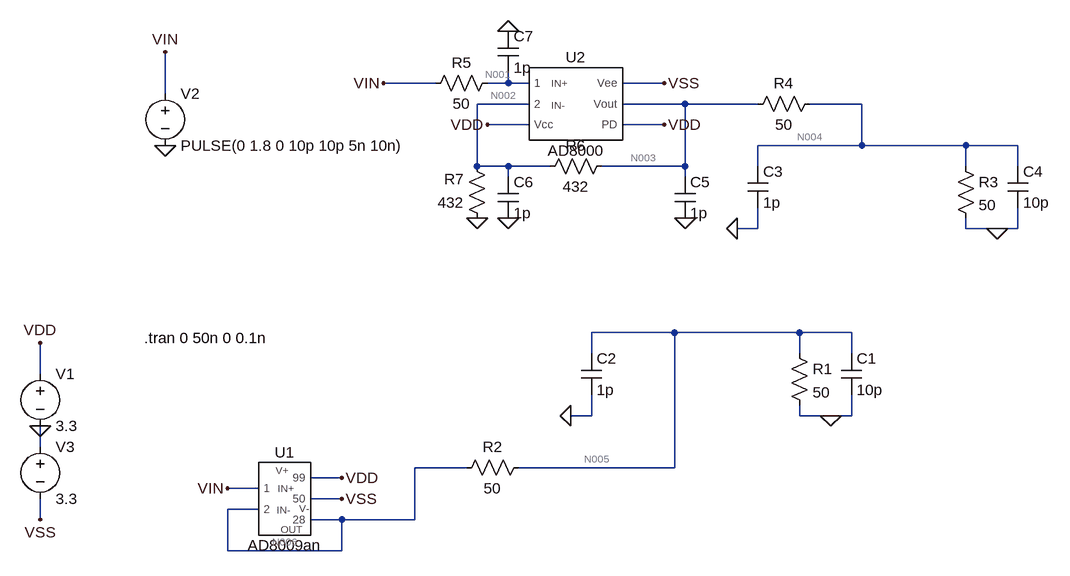
[diagram p0: schematic buffer.asc]
buffer.asc, the LTspice schematic file:
Version 4
SHEET 1 1032 912
WIRE 80 144 0 144
WIRE 192 144 192 128
WIRE 192 144 160 144
WIRE 224 144 192 144
WIRE 432 144 368 144
WIRE -336 160 -336 96
WIRE 224 176 144 176
WIRE 464 176 368 176
WIRE 576 176 464 176
WIRE 736 176 656 176
WIRE 224 208 160 208
WIRE 432 208 368 208
WIRE 736 240 736 176
WIRE 736 240 576 240
WIRE 896 240 736 240
WIRE 976 240 896 240
WIRE 144 272 144 176
WIRE 192 272 144 272
WIRE 256 272 192 272
WIRE 464 272 464 176
WIRE 464 272 336 272
WIRE 576 272 576 240
WIRE 896 272 896 240
WIRE 976 272 976 240
WIRE 192 288 192 272
WIRE 464 288 464 272
WIRE 576 368 576 336
WIRE 576 368 544 368
WIRE 896 368 896 352
WIRE 944 368 896 368
WIRE 976 368 976 336
WIRE 976 368 944 368
WIRE 448 528 320 528
WIRE 640 528 448 528
WIRE 720 528 640 528
WIRE 320 560 320 528
WIRE 640 560 640 528
WIRE 720 560 720 528
WIRE -528 592 -528 544
WIRE 320 656 320 624
WIRE 320 656 288 656
WIRE 640 656 640 640
WIRE 688 656 640 656
WIRE 720 656 720 624
WIRE 720 656 688 656
WIRE -528 704 -528 672
WIRE 128 736 48 736
WIRE 448 736 448 528
WIRE 448 736 208 736
WIRE -64 752 -112 752
WIRE -192 768 -240 768
WIRE -64 784 -112 784
WIRE -192 800 -240 800
WIRE -528 816 -528 784
WIRE -64 816 -112 816
WIRE 48 816 48 736
WIRE 48 816 -64 816
WIRE -240 864 -240 800
WIRE -64 864 -64 816
WIRE -64 864 -240 864
FLAG -336 240 0
FLAG -528 672 0
FLAG 288 656 0
FLAG 688 656 0
FLAG -528 544 VDD
FLAG -336 96 VIN
FLAG -240 768 VIN
FLAG -528 816 VSS
FLAG -64 784 VSS
FLAG -64 752 VDD
FLAG 544 368 0
FLAG 944 368 0
FLAG 160 208 VDD
FLAG 432 144 VSS
FLAG 432 208 VDD
FLAG 0 144 VIN
FLAG 144 352 0
FLAG 192 352 0
FLAG 464 352 0
FLAG 192 64 0
SYMBOL voltage -528 576 R0
WINDOW 123 0 0 Left 0
WINDOW 39 0 0 Left 0
SYMATTR InstName V1
SYMATTR Value 3.3
SYMBOL voltage -336 144 R0
WINDOW 123 0 0 Left 0
WINDOW 39 0 0 Left 0
SYMATTR InstName V2
SYMATTR Value PULSE(0 1.8 0 10p 10p 5n 10n)
SYMBOL cap 304 560 R0
SYMATTR InstName C2
SYMATTR Value 1p
SYMBOL res 624 544 R0
SYMATTR InstName R1
SYMATTR Value 50
SYMBOL cap 704 560 R0
SYMATTR InstName C1
SYMATTR Value 10p
SYMBOL voltage -528 688 R0
WINDOW 123 0 0 Left 0
WINDOW 39 0 0 Left 0
SYMATTR InstName V3
SYMATTR Value 3.3
SYMBOL res 224 720 R90
WINDOW 0 0 56 VBottom 2
WINDOW 3 32 56 VTop 2
SYMATTR InstName R2
SYMATTR Value 50
SYMBOL AD8009an -160 784 R0
SYMATTR InstName U1
SYMBOL AD8000 288 176 R0
SYMATTR InstName U2
SYMBOL cap 560 272 R0
SYMATTR InstName C3
SYMATTR Value 1p
SYMBOL res 880 256 R0
SYMATTR InstName R3
SYMATTR Value 50
SYMBOL cap 960 272 R0
SYMATTR InstName C4
SYMATTR Value 10p
SYMBOL res 672 160 R90
WINDOW 0 0 56 VBottom 2
WINDOW 3 32 56 VTop 2
SYMATTR InstName R4
SYMATTR Value 50
SYMBOL res 176 128 R90
WINDOW 0 0 56 VBottom 2
WINDOW 3 32 56 VTop 2
SYMATTR InstName R5
SYMATTR Value 50
SYMBOL res 352 256 R90
WINDOW 0 0 56 VBottom 2
WINDOW 3 32 56 VTop 2
SYMATTR InstName R6
SYMATTR Value 432
SYMBOL res 160 368 R180
WINDOW 0 36 76 Left 2
WINDOW 3 36 40 Left 2
SYMATTR InstName R7
SYMATTR Value 432
SYMBOL cap 448 288 R0
SYMATTR InstName C5
SYMATTR Value 1p
SYMBOL cap 176 288 R0
SYMATTR InstName C6
SYMATTR Value 1p
SYMBOL cap 176 64 R0
SYMATTR InstName C7
SYMATTR Value 1p
TEXT -368 536 Left 2 !.tran 0 50n 0 0.1n

The netlist it stands for:
* buffer.asc
V1 VDD 0 3.3
V2 VIN 0 PULSE(0 1.8 0 10p 10p 5n 10n)
C2 N005 0 1p
R1 N005 0 50
C1 N005 0 10p
V3 0 VSS 3.3
R2 N005 N006 50
XU1 VIN N006 VDD VSS N006 AD8009an  ; pins 1 2 99 50 28
XU2 N001 N002 VDD VSS N003 VDD AD8000  ; pins 1 2 Vcc Vee Vout PD
C3 N004 0 1p
R3 N004 0 50
C4 N004 0 10p
R4 N004 N003 50
R5 N001 VIN 50
R6 N003 N002 432
R7 0 N002 432
C5 N003 0 1p
C6 N002 0 1p
C7 0 N001 1p
.tran 0 50n 0 0.1n
.lib C:\Users\fath_local\Desktop\pico_contest\ltspice\ad8009.cir
.lib C:\Users\fath_local\Desktop\pico_contest\ltspice\ad8000p.cir
.backanno
.end

* Results of the author's LTspice run, read from the files saved beside the schematic
* Operating Point, zero values left out:
*   V(vdd) = 3.3 V
*   V(n005) = 996 µV
*   V(vss) = -3.3 V
*   V(n006) = 1.992 mV
*   V(n001) = -252.3 µV
*   V(n002) = 739.7 µV
*   V(n003) = 3.654 mV
*   V(n004) = 1.827 mV
*   I(R1) = 19.92 µA
*   I(R2) = -19.92 µA
*   I(R3) = 36.54 µA
*   I(R4) = -36.54 µA
*   I(R5) = -5.045 µA
*   I(R6) = 6.745 µA
*   I(R7) = -1.712 µA
*   I(V1) = -27.81 mA
*   I(V2) = -55.09 µA
*   I(V3) = -27.65 mA
*   Ix(u1:1) = 50.05 µA
*   Ix(u1:2) = 50.05 µA
*   Ix(u1:99) = 14.15 mA
*   Ix(u1:50) = -14.08 mA
*   Ix(u1:28) = -69.97 µA
*   Ix(u2:1) = 5.045 µA
*   Ix(u2:2) = 5.033 µA
*   Ix(u2:VCC) = 13.66 mA
*   Ix(u2:VEE) = -13.57 mA
*   Ix(u2:VOUT) = -43.28 µA
*   Ix(u2:PD) = 330 nA
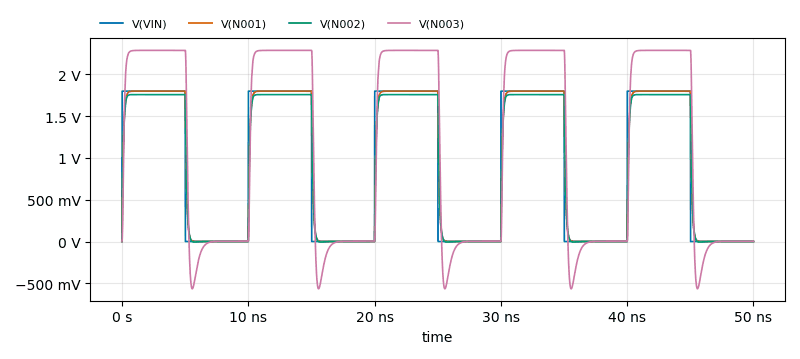
[diagram p1: Transient Analysis of buffer.asc, plotted from the saved traces]
* Transient Analysis, 1 run:
*   V(VIN): min 0 V, max 1.8 V, average 901.8 mV, rms 1.274 V, last 0 V
*   V(N001): min -252.6 µV, max 1.799 V, average 901.1 mV, rms 1.26 V, last -252.3 µV
*   V(N002): min -6.325 mV, max 1.759 V, average 882.1 mV, rms 1.233 V, last 739.7 µV
*   V(N003): min -566.2 mV, max 2.288 V, average 1.108 V, rms 1.606 V, last 3.654 mV